# Altium schematic sheet SHDN-CURRENT-S09-V00-PSU-5V.SchDoc: Power Supply (9-25V to 5V @ 0.1-0.3A)
size A3; DrawnBy: Jonn Dillon; DocumentNumber: 9; Revision: 01; SheetNumber: 9; SheetTotal: 14; Version: 01; Project: Shutdown Current Board 2020; PageSetup: Record=PageOptions|CenterHorizontal=True|CenterVertical=True|PrintScale=0.97|XCorrection=1.00|YCorrection=1.00|PrintKind=0|BorderSize=5000000|LeftOffset=0|BottomOffset=0|Orientation=2|PaperLength=1000|PaperWidth=1000|Scale=100|PaperSource=7|PrintQuality=-4|MediaType=1|DitherType=10|PaperKind=A4|PrintScaleMode=1
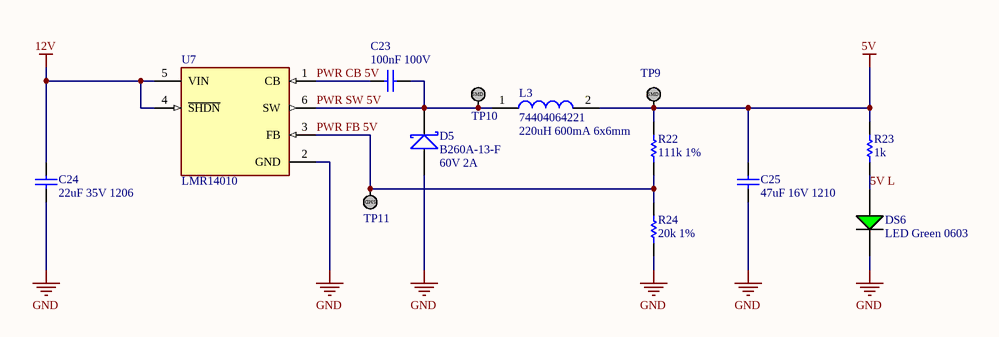
[diagram p0: SHDN-CURRENT-S09-V00-PSU-5V.SchDoc]

## Parts
C23  100nF 100V  [Cap_Ceramic_0603]
C24  22uF 35V 1206  [Cap_Ceramic_1206]
C25  47uF 16V 1210  [Cap_Ceramic_1210]
D5  B260A-13-F  [SMA]
DS6  LED Green 0603  [LED GREEN 0603]
L3  74404064221  [Inductor_6x6mm]
R22  111k 1%  [Res_ThinFilm_0603]
R23  1k  [Res_ThinFilm_0603]
R24  20k 1%  [Res_ThinFilm_0603]
TP9  TestPoint_SMD  [TestPointSMD]  (value not drawn)
TP10  TestPoint_SMD  [TestPointSMD]  (value not drawn)
TP11  TestPoint_SMD  [TestPointSMD]  (value not drawn)
U7  LMR14010  [LMR14010]

## Nets
5V: C25.2 L3.2 R22.2 R23.2 TP9.1
12V: C24.2 U7.4(~{SHDN}) U7.5(VIN)
GND: C24.1 C25.1 D5.A DS6.2(C) R24.1 U7.2(GND)
5V L: DS6.1(A) R23.1
PWR CB 5V: C23.1 U7.1(CB)
PWR FB 5V: R22.1 R24.2 TP11.1 U7.3(FB)
PWR SW 5V: C23.2 D5.K L3.1 TP10.1 U7.6(SW)

## Notes on the sheet
- (near L3) 220uH 600mA 6x6mm
- (near D5) 60V 2A
- Revision History:
- Sheet Title:
- Rev
- Date
- Description
- Project:
- Size:
- Drawn By:
- A3
- Number:
- Revision:
- Sheet
- Version:
- of
- QUT Motorsport
- O-120, Gardens Point
- 2 George Street
- Brisbane, QLD 4000
- Australia
- Print Date:
- Print Time:
- File Name:
- (in symbol TestPoint_SMD) SMD

## Library data of the parts
C23 = 100nF 100V 5% X7R 0603: Capacitor, Ceramic, SMD, 100nF, 100V, 5%, X7R, 0603
C24 = 22uF 35V 10% X7R 1206: Capacitor, Ceramic, SMD, 22uF, 35V, 10%, X7R, 1206
C25 = 47uF 16V 10% X7R 1210: Capacitor, Ceramic, SMD, 47uF, 16V, 5%, X7R, 1210
D5 = B260A-13-F: Diode, Schottky Barrier Rectifier, 60 V, 2 A, B260A-13-F
L3 = 74404064221: FIXED IND 220UH 660MA 850 MOHM; ComponentLink1Description: Digikey; ComponentLink1URL: https://www.digikey.com.au/product-detail/en/w%C3%BCrth-elektronik/74404064221/732-7261-1-ND/5353241; ComponentLink2Description: LCSC A; ComponentLink2URL: https://lcsc.com/product-detail/Power-Inductors_Sunlord-SWPA6045S221MT_C91047.html; ComponentLink3Description: LCSC B; ComponentLink3URL: https://lcsc.com/product-detail/Power-Inductors_SXN-Shun-Xiang-Nuo-Elec-SMNR6045-221MT_C467145.html
R22 = 111k 1% 0603: Resistor, SMD, 111k, 0.1W, 1%, 0603
R23 = 1k 5% 0603: Resistor, SMD, 1k, 0.1W, 5%, 0603
R24 = 20k 1% 0603: Resistor, SMD, 20k, 0.1W, 1%, 0603